# Altium schematic sheet 01_V5_SYS.SchDoc
size A4
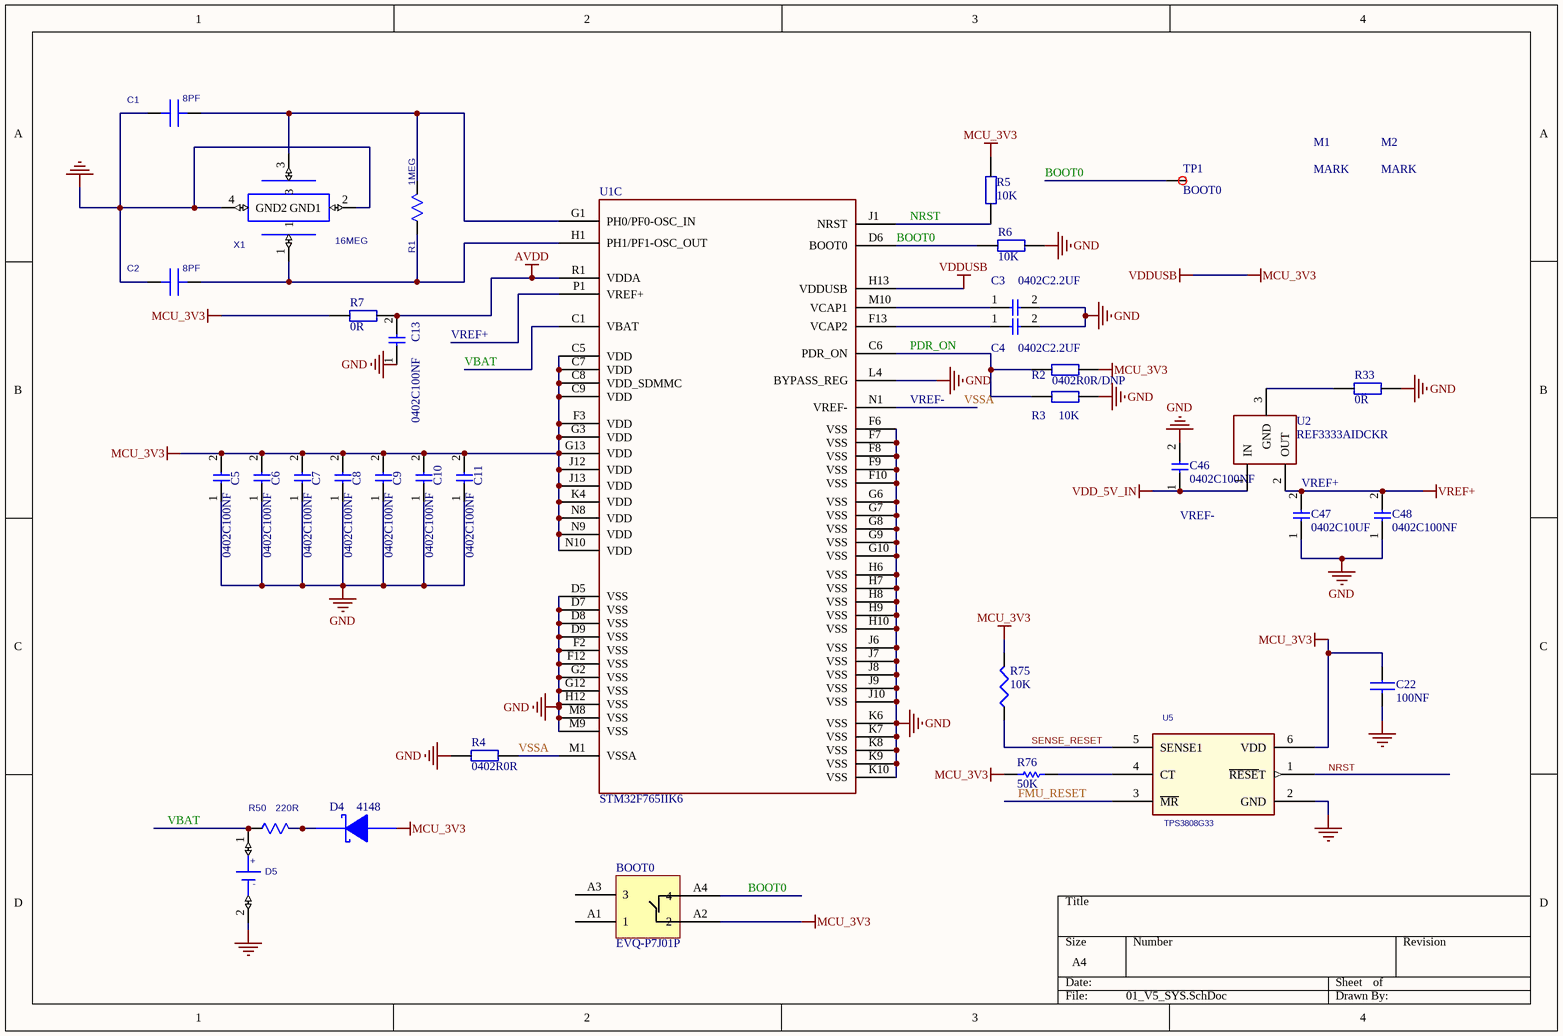
[diagram p0: 01_V5_SYS.SchDoc]

## Parts
BOOT0  EVQ-P7J01P  [EVQ-P7J01P]
C1  8PF  [SC0402]
C2  8PF  [SC0402]
C3  0402C2.2UF  [0402C]
C4  0402C2.2UF  [0402C]
C5  0402C100NF  [0402C]
C6  0402C100NF  [0402C]
C7  0402C100NF  [0402C]
C8  0402C100NF  [0402C]
C9  0402C100NF  [0402C]
C10  0402C100NF  [0402C]
C11  0402C100NF  [0402C]
C13  0402C100NF  [0402C]
C22  100NF  [0402cap]
C46  0402C100NF  [0402C]
C47  0402C10UF  [0402C]
C48  0402C100NF  [0402C]
D4  4148  [SOD323]
D5  PAS414HR-VE5R  [PAS414R-S-VE5R]  (value not drawn)
M1  MARK  [MARK]
M2  MARK  [MARK]
R1  1MEG  [SR0402]
R2  0402R0R/DNP  [0402R]
R3  10K  [0402R]
R4  0402R0R  [0402R]
R5  10K  [0402R]
R6  10K  [0402R]
R7  0R  [0402R]
R33  0R  [0402R]
R50  220R  [0402r]
R75  10K  [R0402]
R76  50K  [0402R]
TP1  BOOT0  [TP0.75]
U1  STM32F765IIK6  [UFBGA176]  (part C of 3)
U2  REF3333AIDCKR  [SC70]
U5  TPS3808G33  [SOT-23-6]
X1  16MEG  [3225]

## Nets
AVDD: C13.2 R7.1 U1.R1(VDDA)
GND: C1.1(A) C2.1(A) C3.2 C4.2 C5.1 C6.1 C7.1 C8.1 C9.1 C10.1 C11.1 C13.1 C22.2 C46.2 C47.1 C48.1 D5.2(-) R3.2 R4.1 R6.1 R33.1 U1.D5(VSS) U1.D7(VSS) U1.D8(VSS) U1.D9(VSS) U1.F2(VSS) U1.F6(VSS) U1.F7(VSS) U1.F8(VSS) U1.F9(VSS) U1.F10(VSS) U1.F12(VSS) U1.G2(VSS) U1.G6(VSS) U1.G7(VSS) U1.G8(VSS) U1.G9(VSS) U1.G10(VSS) U1.G12(VSS) U1.H6(VSS) U1.H7(VSS) U1.H8(VSS) U1.H9(VSS) U1.H10(VSS) U1.H12(VSS) U1.J6(VSS) U1.J7(VSS) U1.J8(VSS) U1.J9(VSS) U1.J10(VSS) U1.K6(VSS) U1.K7(VSS) U1.K8(VSS) U1.K9(VSS) U1.K10(VSS) U1.L4(BYPASS_REG) U1.M8(VSS) U1.M9(VSS) U5.2(GND) X1.2(GND1) X1.4(GND2)
MCU_3V3: BOOT0.A2(2) C5.2 C6.2 C7.2 C8.2 C9.2 C10.2 C11.2 C22.1 D4.A R2.2 R5.2 R7.2 R75.2 R76.2 U1.C5(VDD) U1.C7(VDD) U1.C8(VDD_SDMMC) U1.C9(VDD) U1.F3(VDD) U1.G3(VDD) U1.G13(VDD) U1.H13(VDDUSB) U1.J12(VDD) U1.J13(VDD) U1.K4(VDD) U1.N8(VDD) U1.N9(VDD) U1.N10(VDD) U5.6(VDD)  [also labelled VDDUSB]
VDD_5V_IN: C46.1 U2.1(IN)
VREF+: C47.2 C48.2 U1.P1(VREF+) U2.2(OUT)
BOOT0: BOOT0.A4(4) R6.2 TP1.0 U1.D6(BOOT0)
FMU_RESET: U5.3(~{MR})
NRST: R5.1 U1.J1(NRST) U5.1(~{RESE}T)
PDR_ON: R2.1 R3.1 U1.C6(PDR_ON)
SENSE_RESET: R75.1 U5.5(SENSE1)
VBAT: D5.1(+) R50.1(A) U1.C1(VBAT)
VREF-: R4.2 U1.M1(VSSA) U1.N1(VREF-)  [also labelled VSSA]
NetC1_2: C1.2(B) R1.2(B) U1.G1(PH0/PF0-OSC_IN) X1.3
NetC2_2: C2.2(B) R1.1(A) U1.H1(PH1/PF1-OSC_OUT) X1.1
NetC3_1: C3.1 U1.M10(VCAP1)
NetC4_1: C4.1 U1.F13(VCAP2)
NetD4_K: D4.K R50.2(B)
NetR33_2: R33.2 U2.3(GND)
NetR76_1: R76.1 U5.4(CT)

Not connected (* = marked no-connect by the designer): BOOT0 A1(1) A3(3)

## Notes on the sheet
- (near D5) +
- (near D5) -
- Labels drawn without touching a wire or pin: VREF-

## Library data of the parts
C1 C2 = C
C5-C11 C13 = 0402C100NF: 50V 5%
C22 = C1005X5R1H104K
C46-C48 = 0402C2.2UF
D4 = STPS20M100SG-TR: Manufacturer Name: STMicroelectronics; PackageReference: STPS20M100SG-TR; Manufacturer Part Number: STPS20M100SG-TR; Value: 4148
D5 = PWR1-2_1
R1 = R
R2-R7 R33 = 0402R0R: 0402R0R 1%
R50 = R: PARTS: 1; OriginalSymbolOrigin: (10,20); PINSWAP: (A,B); DEVICE: RK73H1ETTP1004F; PKG_TYPE: SR0402; LEVEL: STD; %208%%161%%192%%224%%195%%251%%179%%198%: 片式厚膜电阻器; COMPONENT_HIGH_MAX: 0.4MM; %215%%232%%214%%181%%212%%202%%208%%237%%198%%171%%178%%238%: +/-1%; %182%%238%%182%%168%%185%%166%%194%%202%(W): 0.06; %195%%232%%202%%246%: 片式厚膜电阻器-0.0625W-1000000OHM-+/-1%-0402; CODE: 7090857
R75 = RMCF0402FT4K99
R76 = Res Semi: Semiconductor Resistor
TP1 = TP_0.75: TP_0.75MM
U2 = REF3333AIDCKT
U5 = TPS3808G09DBVR: IC VOLT SUPERVISOR 0.9V SOT23-6; Part #: 102020-0009R; Manufacturer: Texas Instruments; .Checked PCB: used; Number of Voltages Monitored: 1; Output: Open Drain or Open Collector; Reset: Active Low; Reset Timeout: Adjustable/Selectable; Voltage - Threshold: 0.84V; .Checked SCH: used; Category: Integrated Circuits (ICs); Supplier Part Number: 296-17189-1-ND; Family: PMIC - Supervisors; Manufacturer Part Number: TPS3808G09DBVR; Operating Temperature: -40癈 ~ 125癈; Package / Case: SOT-23-6; Price 1k [$]: 1.12000; Value: TPS3808G09DBVR; Type: Simple Reset/Power-On Reset; Supplier: Digikey; Supplier 1: Digi-Key; Supplier Part Number 1: 296-17189-1-ND; RoHS: RoHS Compliant; Stock 1: 61681; Pricing 1: 1=2.45, 25=1.89, 100=1.715, 250=1.54, 500=1.33, 1000=1.12 (USD); Mounting Type: Surface Mount; Supplier Device Package: SOT-23-6; Packaging: Cut Tape (CT); ComponentLink1URL: http://www.ti.com/lit/ds/symlink/tps3808g01.pdf; ComponentLink1Description: http://www.ti.com/lit/ds/symlink/tps3808g01.pdf
X1 = X_B